# Altium schematic sheet 08_BB_Processor.SchDoc: BB Processor (part 2 of 3)
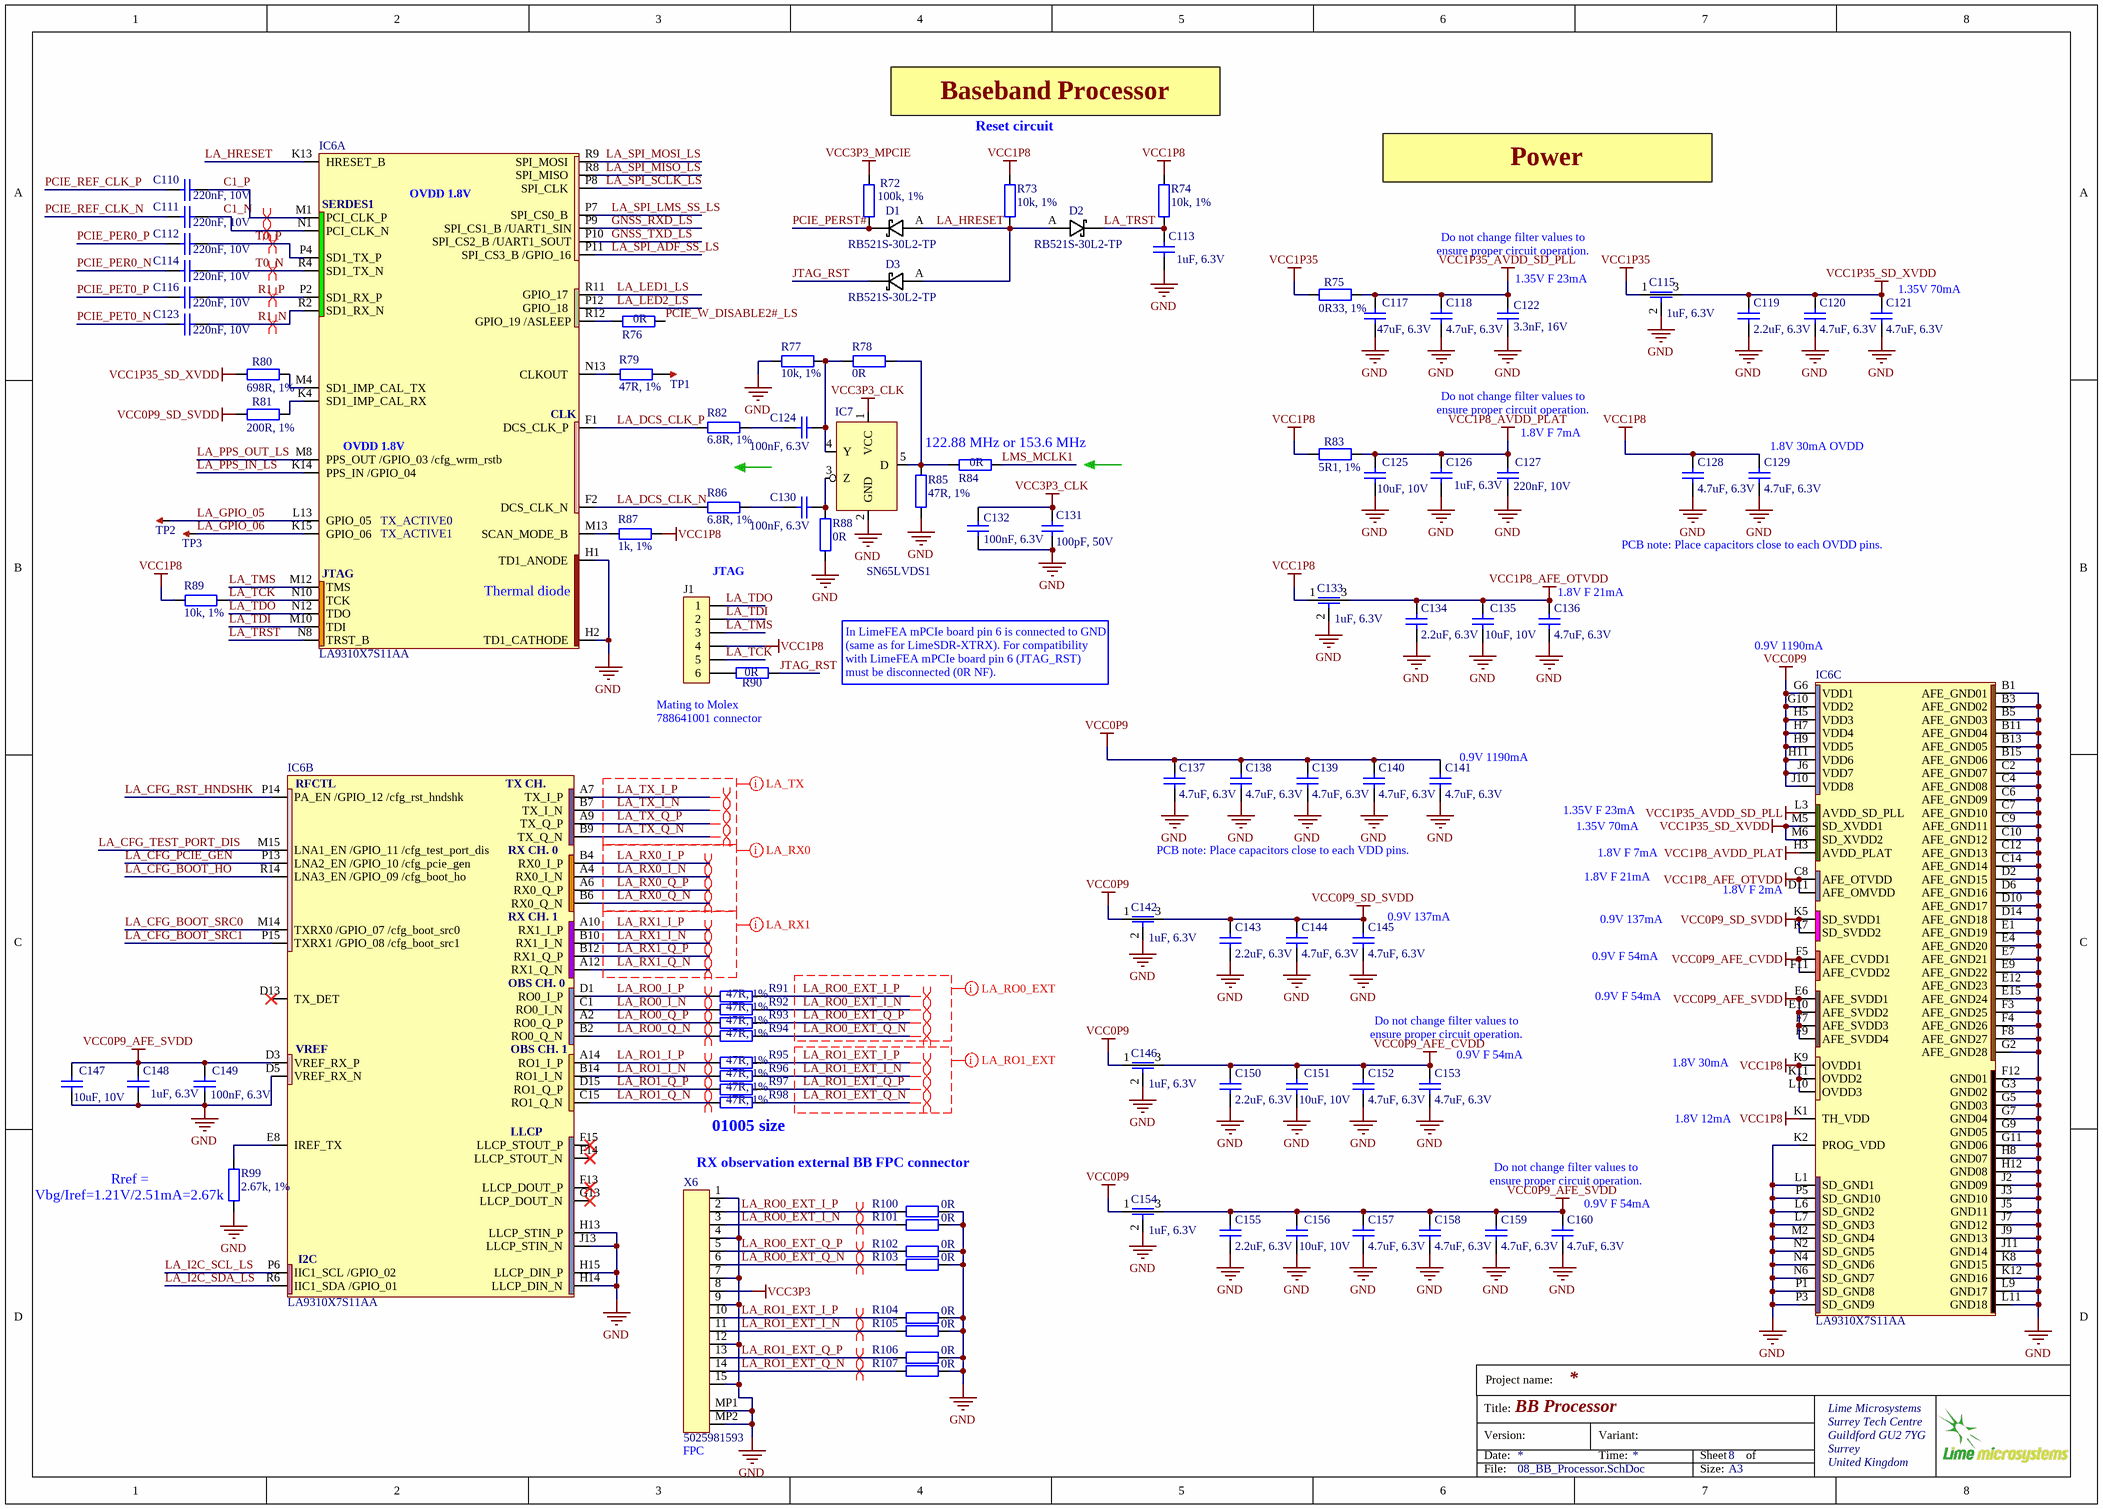
[diagram p1: 08_BB_Processor.SchDoc]
## Library data of the parts
C110-C112 C114 C116 C123 = Cap_0402: Manufacturer: Murata; Manufacturer Part Number 1: GRM033R61A224ME90D; Part Description: 0.22 µF ±20% 10V Ceramic Capacitor X5R 0201 (0603 Metric); Dielectric: X5R; Material: 4241ConductorMaterial; Tolerance: 20%; ComponentLink5Description: https://datasheet.ciiva.com/25788/cl03a104mp3nnnc-25788272.pdf?src-supplier=Digi-Key; ComponentLink5URL: https://datasheet.ciiva.com/25788/cl03a104mp3nnnc-25788272.pdf?src-supplier=Digi-Key; Capacitance: 220nF; Case/Package: 0201; Case Code (Imperial): 0201; Case Code (Metric): 0603; ComponentLink1Description: http://www.mouser.com/ds/2/281/c02e-2905.pdf?src-supplier=Mouser; ComponentLink1URL: http://www.mouser.com/ds/2/281/c02e-2905.pdf?src-supplier=Mouser; ComponentLink2Description: https://datasheet.octopart.com/GRM033R61A224ME90D-Murata-datasheet-22122223.pdf?src-supplier=Future+Electronics; ComponentLink2URL: https://datasheet.octopart.com/GRM033R61A224ME90D-Murata-datasheet-22122223.pdf?src-supplier=Future+Electronics; ComponentLink3Description: http://search.murata.co.jp/Ceramy/image/img/A01X/G101/ENG/GRM033R61A224ME90-01.pdf?src-supplier=Digi-Key; ComponentLink3URL: http://search.murata.co.jp/Ceramy/image/img/A01X/G101/ENG/GRM033R61A224ME90-01.pdf?src-supplier=Digi-Key; ComponentLink4Description: https://datasheet.octopart.com/GRM033R61A224ME90D-Murata-datasheet-165579666.pdf?src-supplier=TME; ComponentLink4URL: https://datasheet.octopart.com/GRM033R61A224ME90D-Murata-datasheet-165579666.pdf?src-supplier=TME; Depth: 0.3mm; Height: 0.3mm; Lead Free: Lead Free; Length: 0.6mm; Max Operating Temperature: 85°C; Min Operating Temperature: -55°C; Mount: Surface Mount; Package Quantity: 15000; Packaging: Tape and Reel; Pricing 1: 1=0,1, 10=0,026, 50=0,0148, 100=0,0115, 500=0,00866, 1000=0,0068, 2500=0,00618, 5000=0,00569 (USD); RoHS: Yes; RoHS Compliant: Yes; Series: GRM; Stock 1: 689026; Supplier 1: Digi-Key; Supplier Part Number 1: 490-9984-1-ND; Termination: SMD/SMT; Thickness: 0.013inch; Value: 220nF, 10V; Voltage: 10V; Voltage Rating (DC): 10V; Voltage Rating: 10V; Weight: 1.2E-05oz; Width: 0.012inch
C113 C126 C148 = Cap_0402: Manufacturer: TDK Corporation; Manufacturer Part Number 1: JMK063ABJ105MP-F; Part Description: 1µF ±20% 6.3V X5R Ceramic Capacitor -55°C ~ 85°C Surface Mount, MLCC 0201 (0603 Metric) 0.024" L x 0.012" W (0.60mm x 0.30mm); Value: 1uF, 20%; Tolerance: ±20%; Capacitance: 1.0µF; Temperature Coefficient: X5R; Supplier 1: Digi-Key; Supplier Part Number 1: 587-5864-2-ND; Applications: General Purpose; Features: -; Lead Style: -; Ratings: -; Thickness (Max): -; Lead Spacing: -; Height - Seated (Max): -; Size / Dimension: 0.024" L x 0.012" W (0.60mm x 0.30mm); Mounting Type: Surface Mount, MLCC; Operating Temperature: -55°C ~ 85°C; Package / Case: 0201 (0603 Metric); Packaging: Cut Tape (CT); Voltage - Rated: 6.3V; Category: Capacitors; RoHS: RoHS Compliant
C115 = Cap_feed_through: Part Description: 1 µF Feed Through Capacitor 6.3V 4 A 12mOhm 0603 (1608 Metric), 4 PC Pad; Manufacturer: TDK; Manufacturer Part Number 1: YFF18PH0J105MT000N; Value: 1uF, 6.3V; Supplier 1: Digi-Key; Supplier Part Number 1: 445-3029-1-ND; Stock 1: 22167; Pricing 1: 1=0,49, 10=0,326, 50=0,2404, 100=0,1957, 500=0,15448, 1000=0,13045 (USD); RoHS: Yes; ComponentLink1URL: http://www.farnell.com/datasheets/2211503.pdf?src-supplier=Farnell; ComponentLink1Description: http://www.farnell.com/datasheets/2211503.pdf?src-supplier=Farnell; ComponentLink2URL: https://product.tdk.com/info/en/catalog/datasheets/3tf_commercial_power_yff-p_en.pdf?ref_disty=digikey&src-supplier=Digi-Key; ComponentLink2Description: https://product.tdk.com/info/en/catalog/datasheets/3tf_commercial_power_yff-p_en.pdf?ref_disty=digikey&src-supplier=Digi-Key
C117 = Cap_0603: Part Description: 47 µF ±20% 6.3V Ceramic Capacitor X5R 0603 (1608 Metric); Manufacturer: Murata; Manufacturer Part Number 1: GRM188R60J476ME15D; Tolerance: 20%; Dielectric: X5R; Value: 47uF, 6.3V; Supplier 1: Digi-Key; Supplier Part Number 1: 490-13247-1-ND; Stock 1: 731453; Pricing 1: 1=0,45000, 10=0,31900, 50=0,24120, 100=0,21000, 500=0,15556, 1000=0,13223 (USD); RoHS: Yes; Mount: Surface Mount; Case/Package: 0603; Case Code (Metric): 1608; Case Code (Imperial): 0603; Min Operating Temperature: -55°C; Max Operating Temperature: 85°C; Packaging: Tape and Reel; Capacitance: 47uF; Voltage Rating: 6.3V; Voltage Rating (DC): 6.3V; Length: 0.063inch; Width: 0.031inch; Thickness: 0.039inch; RoHS Compliant: Yes; ComponentLink1URL: http://search.murata.co.jp/Ceramy/image/img/A01X/G101/ENG/GRM188R60J476ME15-01.pdf?src-supplier=Digi-Key; ComponentLink1Description: http://search.murata.co.jp/Ceramy/image/img/A01X/G101/ENG/GRM188R60J476ME15-01.pdf?src-supplier=Digi-Key; ComponentLink2URL: https://www.murata.com/~/media/webrenewal/support/library/catalog/products/capacitor/mlcc/c02e.ashx?la=en-us&src-supplier=Digi-Key; ComponentLink2Description: https://www.murata.com/~/media/webrenewal/support/library/catalog/products/capacitor/mlcc/c02e.ashx?la=en-us&src-supplier=Digi-Key
C118 = Cap_0402: Part Description: 4.7 µF ±20% 6.3V Ceramic Capacitor X5R 0201 (0603 Metric); Manufacturer: Murata; Manufacturer Part Number 1: GRM035R60J475ME15J; Material: 4241ConductorMaterial; Dielectric: 1537DielectricType; Tolerance: 20%; Value: 4.7uF, 6.3V; Supplier 1: Digi-Key; Supplier Part Number 1: 490-GRM035R60J475ME15JCT-ND; Stock 1: 92210; Pricing 1: 1=0,28, 10=0,183, 50=0,1154, 100=0,0923, 500=0,06668, 1000=0,05899, 2500=0,05642, 5000=0,05129 (USD); RoHS: Yes; Case/Package: 344Case; Min Operating Temperature: -55°C; Max Operating Temperature: 85°C; Capacitance: 4.7uF; Voltage Rating: 6.3V; Voltage Rating (DC): 6.3V; Length: 600um; Width: 300um; Height: 550um; Thickness: 500um; RoHS Compliant: Yes; ComponentLink1URL: https://datasheet.octopart.com/GRM035R60J475ME15J-Murata-datasheet-165579666.pdf?src-supplier=TME; ComponentLink1Description: https://datasheet.octopart.com/GRM035R60J475ME15J-Murata-datasheet-165579666.pdf?src-supplier=TME
C119 = Cap_0402: Part Description: CAP CER 2.2UF 6.3V X5R 0201; Manufacturer: Murata; Manufacturer Part Number 1: GRM033R60J225ME47D; Material: Ceramic; Tolerance: 20%; Dielectric: X5R; Value: 2.2uF, 6.3V; Supplier 1: Digi-Key; Supplier Part Number 1: 490-13225-1-ND; Stock 1: 8554536; Pricing 1: 1=0,19, 10=0,121, 50=0,0764, 100=0,0612, 500=0,04418, 1000=0,03909, 2500=0,03739, 5000=0,03399 (USD); RoHS: Yes; Mount: Surface Mount; Case/Package: 0201; Case Code (Metric): 0603; Case Code (Imperial): 0201; Min Operating Temperature: -55°C; Max Operating Temperature: 85°C; Packaging: Cut Tape; Capacitance: 2.2uF; Voltage Rating: 6.3V; Series: GRM; Voltage Rating (DC): 6.3V; Length: 0.024inch; Width: 0.012inch; Height: 390um; Thickness: 0.015inch; RoHS Compliant: Yes; ComponentLink1URL: https://datasheet.octopart.com/GRM033R60J225ME47D-Murata-datasheet-96971104.pdf?src-supplier=Future+Electronics; ComponentLink1Description: https://datasheet.octopart.com/GRM033R60J225ME47D-Murata-datasheet-96971104.pdf?src-supplier=Future+Electronics; ComponentLink2URL: http://search.murata.co.jp/Ceramy/image/img/A01X/G101/ENG/GRM033R60J225ME47-01.pdf?src-supplier=Digi-Key; ComponentLink2Description: http://search.murata.co.jp/Ceramy/image/img/A01X/G101/ENG/GRM033R60J225ME47-01.pdf?src-supplier=Digi-Key; ComponentLink3URL: https://datasheet.octopart.com/GRM033R60J225ME47D-Murata-datasheet-165579666.pdf?src-supplier=TME; ComponentLink3Description: https://datasheet.octopart.com/GRM033R60J225ME47D-Murata-datasheet-165579666.pdf?src-supplier=TME
C120 C121 C128 C129 C136-C141 C144 C145 C152 C153 C157-C160 = Cap_0402: Manufacturer: Murata; Manufacturer Part Number 1: GRM035R60J475ME15J; Part Description: 4.7 µF ±20% 6.3V Ceramic Capacitor X5R 0201 (0603 Metric); Dielectric: 1537DielectricType; Material: 4241ConductorMaterial; Tolerance: 20%; Capacitance: 4.7uF; Case/Package: 344Case; ComponentLink1Description: https://datasheet.octopart.com/GRM035R60J475ME15J-Murata-datasheet-165579666.pdf?src-supplier=TME; ComponentLink1URL: https://datasheet.octopart.com/GRM035R60J475ME15J-Murata-datasheet-165579666.pdf?src-supplier=TME; Height: 550um; Length: 600um; Max Operating Temperature: 85°C; Min Operating Temperature: -55°C; Pricing 1: 1=0,28, 10=0,183, 50=0,1154, 100=0,0923, 500=0,06668, 1000=0,05899, 2500=0,05642, 5000=0,05129 (USD); RoHS: Yes; RoHS Compliant: Yes; Stock 1: 92210; Supplier 1: Digi-Key; Supplier Part Number 1: 490-GRM035R60J475ME15JCT-ND; Thickness: 500um; Value: 4.7uF, 6.3V; Voltage Rating (DC): 6.3V; Voltage Rating: 6.3V; Width: 300um
C122 = Cap_0402: Part Description: 3300 pF ±10% 16V Ceramic Capacitor X7R 0201 (0603 Metric); Manufacturer: Murata; Manufacturer Part Number 1: GRM033R71C332KA88D; Value: 3.3nF, 16V; ComponentLink5Description: https://datasheet.ciiva.com/25788/cl03a104mp3nnnc-25788272.pdf?src-supplier=Digi-Key; ComponentLink5URL: https://datasheet.ciiva.com/25788/cl03a104mp3nnnc-25788272.pdf?src-supplier=Digi-Key; ComponentLink1URL: https://datasheet.ciiva.com/18699/grm033r61c333ke84-01-18699265.pdf?src-supplier=Digi-Key; ComponentLink1Description: https://datasheet.ciiva.com/18699/grm033r61c333ke84-01-18699265.pdf?src-supplier=Digi-Key; ComponentLink2URL: https://datasheet.ciiva.com/24223/c02e-24223974.pdf?src-supplier=Mouser; ComponentLink2Description: https://datasheet.ciiva.com/24223/c02e-24223974.pdf?src-supplier=Mouser; Supplier 1: Digikey; Supplier Part Number 1: 490-3191-1-ND; Stock 1: 176450; Pricing 1: 1=0,1, 10=0,02, 50=0,0118, 100=0,0091, 500=0,00684, 1000=0,00538, 2500=0,00489, 5000=0,0045 (USD); RoHS: Yes; Lead Free: 5697LeadFree; ComponentLink3URL: https://datasheet.ciiva.com/18184/getdatasheetpartid-467171-18184093.pdf?src-supplier=Verical; ComponentLink3Description: https://datasheet.ciiva.com/18184/getdatasheetpartid-467171-18184093.pdf?src-supplier=Verical; ComponentLink4URL: https://datasheet.ciiva.com/129/grm033r71c332ka88-01-129900.pdf?src-supplier=Digikey; ComponentLink4Description: https://datasheet.ciiva.com/129/grm033r71c332ka88-01-129900.pdf?src-supplier=Digikey; ComponentLink6URL: https://datasheet.ciiva.com/129/grm033r71c332ka88-01-129901.pdf?src-supplier=Digikey; ComponentLink6Description: https://datasheet.ciiva.com/129/grm033r71c332ka88-01-129901.pdf?src-supplier=Digikey; ComponentLink7URL: https://datasheet.ciiva.com/129/grm033r71c332ka88-01-129902.pdf?src-supplier=Digikey; ComponentLink7Description: https://datasheet.ciiva.com/129/grm033r71c332ka88-01-129902.pdf?src-supplier=Digikey; ComponentLink8URL: https://datasheet.ciiva.com/11620/product-11620449.pdf?src-supplier=Avnet; ComponentLink8Description: https://datasheet.ciiva.com/11620/product-11620449.pdf?src-supplier=Avnet
C124 C130 C132 C149 = Cap_0402: Part Description: 0.1 µF ±20% 10V Ceramic Capacitor X5R 0201 (0603 Metric); Manufacturer: Samsung; Manufacturer Part Number 1: CL03A104MP3NNNC; Tolerance: 20%; Voltage Rating (DC): 10V; Value: 100nF, 6.3V; Capacitance: 100nF; Case/Package: 0201; Case Code (Imperial): 0201; Case Code (Metric): 0603; ComponentLink5Description: https://datasheet.ciiva.com/25788/cl03a104mp3nnnc-25788272.pdf?src-supplier=Digi-Key; ComponentLink5URL: https://datasheet.ciiva.com/25788/cl03a104mp3nnnc-25788272.pdf?src-supplier=Digi-Key; Length: 0.024inch; Max Operating Temperature: 85°C; Min Operating Temperature: -55°C; Mount: Surface Mount; Package Quantity: 1; Packaging: Tape and Reel; Pricing 1: 1=0,10000, 10=0,03000, 50=0,01640, 100=0,01330, 500=0,00950, 1000=0,00747, 2500=0,00679, 5000=0,00625 (USD); RoHS: Yes; RoHS Compliant: Yes; Series: CL; Stock 1: 3817176; Supplier 1: Digi-Key; Supplier Part Number 1: 1276-1321-1-ND; Thickness: 0.013inch; Voltage Rating: 10V; Width: 0.012inch
C125 C135 C147 C151 C156 = Cap_0603: Part Description: 10 µF ±20% 10V Ceramic Capacitor X5R 0402 (1005 Metric); Manufacturer: Murata; Manufacturer Part Number 1: GRM155R61A106ME11D; Value: 10uF, 10V; ComponentLink1Description: http://search.murata.co.jp/Ceramy/image/img/A01X/G101/ENG/GRM188R61C106MAAL-01.pdf?src-supplier=Digi-Key; ComponentLink1URL: http://search.murata.co.jp/Ceramy/image/img/A01X/G101/ENG/GRM188R61C106MAAL-01.pdf?src-supplier=Digi-Key; ComponentLink2Description: https://search.murata.co.jp/Ceramy/image/img/A01X/G101/ENG/GRM188R61C106MAAL-01.pdf?src-supplier=Digi-Key; ComponentLink2URL: https://search.murata.co.jp/Ceramy/image/img/A01X/G101/ENG/GRM188R61C106MAAL-01.pdf?src-supplier=Digi-Key; ComponentLink3Description: http://search.murata.co.jp/Ceramy/image/img/A01X/partnumbering_e_01.pdf?src-supplier=Digi-Key; ComponentLink3URL: http://search.murata.co.jp/Ceramy/image/img/A01X/partnumbering_e_01.pdf?src-supplier=Digi-Key; ComponentLink4Description: http://www.farnell.com/datasheets/1872210.pdf?src-supplier=Farnell; ComponentLink4URL: http://www.farnell.com/datasheets/1872210.pdf?src-supplier=Farnell; ComponentLink5Description: http://www.mouser.com/ds/2/281/c02e-2905.pdf?src-supplier=Mouser; ComponentLink5URL: http://www.mouser.com/ds/2/281/c02e-2905.pdf?src-supplier=Mouser; ComponentLink6Description: http://www.farnell.com/datasheets/1872210.pdf?src-supplier=Newark; ComponentLink6URL: http://www.farnell.com/datasheets/1872210.pdf?src-supplier=Newark; ComponentLink7Description: http://www.farnell.com/datasheets/2048014.pdf?src-supplier=Element14; ComponentLink7URL: http://www.farnell.com/datasheets/2048014.pdf?src-supplier=Element14; ComponentLink8Description: http://www.farnell.com/datasheets/1872210.pdf?src-supplier=Element14; ComponentLink8URL: http://www.farnell.com/datasheets/1872210.pdf?src-supplier=Element14; ComponentLink9Description: http://search.murata.co.jp/Ceramy/image/img/A01X/G101/ENG/GRM188R61A106ME69-01.pdf?src-supplier=Digi-Key; ComponentLink9URL: http://search.murata.co.jp/Ceramy/image/img/A01X/G101/ENG/GRM188R61A106ME69-01.pdf?src-supplier=Digi-Key; Supplier 1: Digi-Key; Supplier Part Number 1: 490-GRM155R61A106ME11DCT-ND; Stock 1: 185401; Pricing 1: 1=0,13, 10=0,091, 50=0,054, 100=0,0425, 500=0,03142, 1000=0,02601, 2500=0,0242, 5000=0,02214 (USD); RoHS: Yes; RoHS Compliant: Yes; ComponentLink10URL: https://datasheet.octopart.com/GRM155R61A106ME11D-Murata-datasheet-155239053.pdf?src-supplier=Element14; ComponentLink10Description: https://datasheet.octopart.com/GRM155R61A106ME11D-Murata-datasheet-155239053.pdf?src-supplier=Element14; ComponentLink11URL: https://datasheet.octopart.com/GRM155R61A106ME11D-Murata-datasheet-165579666.pdf?src-supplier=TME; ComponentLink11Description: https://datasheet.octopart.com/GRM155R61A106ME11D-Murata-datasheet-165579666.pdf?src-supplier=TME
C127 = Cap_0402: Part Description: 0.22 µF ±20% 10V Ceramic Capacitor X5R 0201 (0603 Metric); Manufacturer: Murata; Manufacturer Part Number 1: GRM033R61A224ME90D; Material: 4241ConductorMaterial; Tolerance: 20%; Dielectric: X5R; Value: 220nF, 10V; ComponentLink5Description: https://datasheet.ciiva.com/25788/cl03a104mp3nnnc-25788272.pdf?src-supplier=Digi-Key; ComponentLink5URL: https://datasheet.ciiva.com/25788/cl03a104mp3nnnc-25788272.pdf?src-supplier=Digi-Key; Supplier 1: Digi-Key; Supplier Part Number 1: 490-9984-1-ND; Stock 1: 689026; Pricing 1: 1=0,1, 10=0,026, 50=0,0148, 100=0,0115, 500=0,00866, 1000=0,0068, 2500=0,00618, 5000=0,00569 (USD); RoHS: Yes; Mount: Surface Mount; Case/Package: 0201; Case Code (Metric): 0603; Case Code (Imperial): 0201; Weight: 1.2E-05oz; Min Operating Temperature: -55°C; Max Operating Temperature: 85°C; Capacitance: 220nF; Voltage Rating (DC): 10V; Packaging: Tape and Reel; Voltage Rating: 10V; Voltage: 10V; Termination: SMD/SMT; Package Quantity: 15000; Series: GRM; Length: 0.6mm; Width: 0.012inch; Height: 0.3mm; Thickness: 0.013inch; Depth: 0.3mm; Lead Free: Lead Free; RoHS Compliant: Yes; ComponentLink1URL: http://www.mouser.com/ds/2/281/c02e-2905.pdf?src-supplier=Mouser; ComponentLink1Description: http://www.mouser.com/ds/2/281/c02e-2905.pdf?src-supplier=Mouser; ComponentLink2URL: https://datasheet.octopart.com/GRM033R61A224ME90D-Murata-datasheet-22122223.pdf?src-supplier=Future+Electronics; ComponentLink2Description: https://datasheet.octopart.com/GRM033R61A224ME90D-Murata-datasheet-22122223.pdf?src-supplier=Future+Electronics; ComponentLink3URL: http://search.murata.co.jp/Ceramy/image/img/A01X/G101/ENG/GRM033R61A224ME90-01.pdf?src-supplier=Digi-Key; ComponentLink3Description: http://search.murata.co.jp/Ceramy/image/img/A01X/G101/ENG/GRM033R61A224ME90-01.pdf?src-supplier=Digi-Key; ComponentLink4URL: https://datasheet.octopart.com/GRM033R61A224ME90D-Murata-datasheet-165579666.pdf?src-supplier=TME; ComponentLink4Description: https://datasheet.octopart.com/GRM033R61A224ME90D-Murata-datasheet-165579666.pdf?src-supplier=TME
C131 = Cap_0402: Part Description: 100 pF ±5% 50V Ceramic Capacitor C0G, NP0 0201 (0603 Metric); Manufacturer: TDK; Manufacturer Part Number 1: C0603C0G1H101J030BA; Dielectric Material: Ceramic; Tolerance: 5%; Dielectric: C0G; Insulation Resistance: 10GR; Value: 100pF, 50V; Supplier 1: Digi-Key; Supplier Part Number 1: 445-1786-1-ND; Stock 1: 367528; Pricing 1: 1=0,10000, 10=0,06000, 50=0,03280, 100=0,02670, 500=0,01908, 1000=0,01500, 2500=0,01364, 5000=0,01254 (USD); RoHS: Yes; Mount: Surface Mount; Case/Package: 0201; Number of Pins: 2; Case Code (Metric): 0603; Case Code (Imperial): 0201; Weight: 6E-06oz; Min Operating Temperature: -55°C; Max Operating Temperature: 125°C; Package Quantity: 1; Capacitance: 100pF; Voltage Rating: 50V; Packaging: Tape and Reel; Voltage Rating (DC): 50V; Termination: SMD/SMT; Voltage: 50V; Series: C; Construction: Flat; Length: 0.6mm; Width: 0.012inch; Height: 0.3mm; Thickness: 0.013inch; Depth: 0.3mm; Reach SVHC Compliant: Yes; Lead Free: Lead Free; RoHS Compliant: Yes; ComponentLink1URL: https://datasheet.ciiva.com/24217/c0603c0g1h101j030ba-264106-24217425.pdf?src-supplier=Mouser; ComponentLink1Description: https://datasheet.ciiva.com/24217/c0603c0g1h101j030ba-264106-24217425.pdf?src-supplier=Mouser; ComponentLink2URL: https://datasheet.ciiva.com/16205/mlcc-commercial-general-en-16205590.pdf?src-supplier=Future+Electronics; ComponentLink2Description: https://datasheet.ciiva.com/16205/mlcc-commercial-general-en-16205590.pdf?src-supplier=Future+Electronics; ComponentLink3URL: https://datasheet.ciiva.com/6250/tdkmlcccaprange-6250351.pdf?src-supplier=Digi-Key; ComponentLink3Description: https://datasheet.ciiva.com/6250/tdkmlcccaprange-6250351.pdf?src-supplier=Digi-Key
C133 C142 C146 C154 = Cap_feed_through: Manufacturer: TDK; Manufacturer Part Number 1: YFF18PH0J105MT000N; Part Description: 1 µF Feed Through Capacitor 6.3V 4 A 12mOhm 0603 (1608 Metric), 4 PC Pad; ComponentLink1Description: http://www.farnell.com/datasheets/2211503.pdf?src-supplier=Farnell; ComponentLink1URL: http://www.farnell.com/datasheets/2211503.pdf?src-supplier=Farnell; ComponentLink2Description: https://product.tdk.com/info/en/catalog/datasheets/3tf_commercial_power_yff-p_en.pdf?ref_disty=digikey&src-supplier=Digi-Key; ComponentLink2URL: https://product.tdk.com/info/en/catalog/datasheets/3tf_commercial_power_yff-p_en.pdf?ref_disty=digikey&src-supplier=Digi-Key; Pricing 1: 1=0,49, 10=0,326, 50=0,2404, 100=0,1957, 500=0,15448, 1000=0,13045 (USD); RoHS: Yes; Stock 1: 22167; Supplier 1: Digi-Key; Supplier Part Number 1: 445-3029-1-ND; Value: 1uF, 6.3V
C134 C143 C150 C155 = Cap_0402: Manufacturer: Murata; Manufacturer Part Number 1: GRM033R60J225ME47D; Part Description: CAP CER 2.2UF 6.3V X5R 0201; Dielectric: X5R; Material: Ceramic; Tolerance: 20%; Capacitance: 2.2uF; Case/Package: 0201; Case Code (Imperial): 0201; Case Code (Metric): 0603; ComponentLink1Description: https://datasheet.octopart.com/GRM033R60J225ME47D-Murata-datasheet-96971104.pdf?src-supplier=Future+Electronics; ComponentLink1URL: https://datasheet.octopart.com/GRM033R60J225ME47D-Murata-datasheet-96971104.pdf?src-supplier=Future+Electronics; ComponentLink2Description: http://search.murata.co.jp/Ceramy/image/img/A01X/G101/ENG/GRM033R60J225ME47-01.pdf?src-supplier=Digi-Key; ComponentLink2URL: http://search.murata.co.jp/Ceramy/image/img/A01X/G101/ENG/GRM033R60J225ME47-01.pdf?src-supplier=Digi-Key; ComponentLink3Description: https://datasheet.octopart.com/GRM033R60J225ME47D-Murata-datasheet-165579666.pdf?src-supplier=TME; ComponentLink3URL: https://datasheet.octopart.com/GRM033R60J225ME47D-Murata-datasheet-165579666.pdf?src-supplier=TME; Height: 390um; Length: 0.024inch; Max Operating Temperature: 85°C; Min Operating Temperature: -55°C; Mount: Surface Mount; Packaging: Cut Tape; Pricing 1: 1=0,19, 10=0,121, 50=0,0764, 100=0,0612, 500=0,04418, 1000=0,03909, 2500=0,03739, 5000=0,03399 (USD); RoHS: Yes; RoHS Compliant: Yes; Series: GRM; Stock 1: 8554536; Supplier 1: Digi-Key; Supplier Part Number 1: 490-13225-1-ND; Thickness: 0.015inch; Value: 2.2uF, 6.3V; Voltage Rating (DC): 6.3V; Voltage Rating: 6.3V; Width: 0.012inch
D1-D3 = BAT46JFILM_shottky_diode: Manufacturer: MCC; Part Description: DIODE SCHOTTKY 30V 100MA 2TDFN; Average Rectified Current: 100mA; Max Reverse Voltage (DC): 30V; Value: RB521S-30L2-TP; Supplier 1: Digi-Key; Supplier Part Number 1: RB521S-30L2-TPMSCT-ND; Manufacturer Part Number 1: RB521S-30L2-TP; Stock 1: 268886; Pricing 1: 1=0,24, 10=0,165, 100=0,0805, 500=0,06712, 1000=0,04664, 2000=0,04043, 5000=0,0375 (USD); RoHS: Yes; Mount: Surface Mount; Case/Package: 0402; Case Code (Imperial): 0402; Case Code (Metric): 1006; Packaging: Cut Tape; Series: -; RoHS Compliant: Yes; ComponentLink1URL: http://www.mccsemi.com/up_pdf/RB521S-30L2(DFN1006-2L)-A.pdf?src-supplier=Digi-Key; ComponentLink1Description: http://www.mccsemi.com/up_pdf/RB521S-30L2(DFN1006-2L)-A.pdf?src-supplier=Digi-Key
IC6 = LA9310X7S11AA: Part Description: LFBGA157, low profile, fine-pitch ball grid array package, 157 terminals, 0.5 mm pitch, 8 mm x 8 mm x 1.25 mm body.; Manufacturer: NXP Semiconductors; Manufacturer Part Number 1: LA9310X7S11AA; Supplier 1: NXP Semiconductors; Supplier Part Number 1: LA9310X7S11AA
IC7 = SN65LVDS1: Manufacturer: TEXAS INSTRUMENTS; Manufacturer Part Number 1: SN65LVDS1DBVR; Part Description: DIFFERENTIAL LINE DRIVER/RECEIVER SIGNAL SOT23-5; Supply Voltage Min: 2.4; Supply Voltage Max: 3.6; No. of Pins: 5; Driver Case Style: SOT-23; Supplier 1: Newark; Supplier Part Number 1: 76C0715
J1 = Molex_0788641001_spring_contacts: Header, 6-pin; Part Description: 6 Position Spring Battery Contact Connector Surface Mount; Manufacturer Part Number 1: 78864-1001; Voltage Rating: 10V; Number of Contacts: 6; Glow Wire Compliant: Non-compliant; Supplier 1: Digi-Key; Supplier Part Number 1: WM11204CT-ND; Manufacturer: Molex; Stock 1: 133097; Pricing 1: 1=0,45000, 10=0,36500, 100=0,26730, 1000=0,21263 (USD); RoHS: Yes; Contact Material: Copper Alloy; Orientation: Vertical; Voltage Rating (DC): 10V; Number of Circuits: 6; Halogen Free: Low Halogen; ComponentLink1URL: http://www.farnell.com/datasheets/2216617.pdf?src-supplier=Farnell; ComponentLink1Description: http://www.farnell.com/datasheets/2216617.pdf?src-supplier=Farnell; ComponentLink2URL: http://www.farnell.com/datasheets/2216617.pdf?src-supplier=Newark; ComponentLink2Description: http://www.farnell.com/datasheets/2216617.pdf?src-supplier=Newark; ComponentLink3URL: http://www.farnell.com/datasheets/1862322.pdf?src-supplier=Element14; ComponentLink3Description: http://www.farnell.com/datasheets/1862322.pdf?src-supplier=Element14
R72 = Res_0402: Part Description: 100 kOhms ±1% 0.05W, 1/20W Chip Resistor 0201 (0603 Metric) Moisture Resistant Thick Film; Manufacturer: Yageo; Manufacturer Part Number 1: RC0201FR-07100KL; Resistance: 100kR; Power Rating: 50mW; Voltage Rating: 25V; Temperature Coefficient: 200ppm/°C; ComponentLink1URL: https://datasheet.ciiva.com/7672/1563626-7672204.pdf?src-supplier=Element14; ComponentLink1Description: https://datasheet.ciiva.com/7672/1563626-7672204.pdf?src-supplier=Element14; Value: 100k, 1%; Supplier 1: Digi-Key; Supplier Part Number 1: 311-100KMCT-ND; Stock 1: 6001055; Pricing 1: 1=0,10000, 10=0,03700, 100=0,01500, 1000=0,00672, 2500=0,00583, 5000=0,00482 (USD); RoHS: Yes; Case/Package: 0201; Case Code (Metric): 0603; Case Code (Imperial): 0201; Min Operating Temperature: -55°C; Max Operating Temperature: 125°C; Tolerance: 1%; Packaging: Tape and Reel; Package Quantity: 10000; Resistor Type: Thick Film; Number of Terminations: 2; Termination: SMD/SMT; Max Power Dissipation: 50mW; Features: Moisture Resistant; Series: RC; Construction: Rectangular; Resistance Tolerance: 1%; Length: 0.024inch; Width: 0.012inch; Height: 0.01inch; Depth: 0.3mm; Military Standard: Not; RoHS Compliant: Yes; ComponentLink2URL: https://datasheet.ciiva.com/22698/1563626-22698505.pdf?src-supplier=Element14; ComponentLink2Description: https://datasheet.ciiva.com/22698/1563626-22698505.pdf?src-supplier=Element14; ComponentLink3URL: https://datasheet.ciiva.com/29721/pyu-r-int-thick-7-29721196.pdf?src-supplier=Digi-Key; ComponentLink3Description: https://datasheet.ciiva.com/29721/pyu-r-int-thick-7-29721196.pdf?src-supplier=Digi-Key; ComponentLink4Description: https://datasheet.ciiva.com/29721/pyu-r-int-thick-7-29721195.pdf?src-supplier=Digi-Key; ComponentLink4URL: https://datasheet.ciiva.com/29721/pyu-r-int-thick-7-29721195.pdf?src-supplier=Digi-Key; ComponentLink5Description: https://datasheet.ciiva.com/8896/pyu-rc0201-51-rohs-l-8-8896174.pdf?src-supplier=Avnet; ComponentLink5URL: https://datasheet.ciiva.com/8896/pyu-rc0201-51-rohs-l-8-8896174.pdf?src-supplier=Avnet; ComponentLink6Description: https://datasheet.ciiva.com/7660/1421516-7660806.pdf?src-supplier=Element14; ComponentLink6URL: https://datasheet.ciiva.com/7660/1421516-7660806.pdf?src-supplier=Element14; ComponentLink7Description: https://datasheet.ciiva.com/22698/1563626-22698495.pdf?src-supplier=Element14; ComponentLink7URL: https://datasheet.ciiva.com/22698/1563626-22698495.pdf?src-supplier=Element14; ComponentLink8Description: https://datasheet.ciiva.com/46391/1421516-46391338.pdf?src-supplier=Element14; ComponentLink8URL: https://datasheet.ciiva.com/46391/1421516-46391338.pdf?src-supplier=Element14; ComponentLink9Description: https://datasheet.ciiva.com/2493/pyu-r-int-thick-7-2493770.pdf?src-supplier=Digi-Key; ComponentLink9URL: https://datasheet.ciiva.com/2493/pyu-r-int-thick-7-2493770.pdf?src-supplier=Digi-Key; ComponentLink10Description: https://datasheet.ciiva.com/2493/pyu-r-int-thick-7-2493771.pdf?src-supplier=Digi-Key; ComponentLink10URL: https://datasheet.ciiva.com/2493/pyu-r-int-thick-7-2493771.pdf?src-supplier=Digi-Key; ComponentLink11Description: https://datasheet.ciiva.com/2493/pyu-r-int-thick-7-2493769.pdf?src-supplier=Digi-Key; ComponentLink11URL: https://datasheet.ciiva.com/2493/pyu-r-int-thick-7-2493769.pdf?src-supplier=Digi-Key; ComponentLink12Description: https://datasheet.ciiva.com/26829/getdatasheetpartid-420441-26829850.pdf?src-supplier=Verical; ComponentLink12URL: https://datasheet.ciiva.com/26829/getdatasheetpartid-420441-26829850.pdf?src-supplier=Verical; Contact Plating: Tin,Matte; Lead Free: Lead Free; Number of Pins: 2; Reach SVHC Compliant: Yes; Size Code: 0201; Voltage Rating (DC): 25V
R73 R74 R77 R89 = Res_0402: Manufacturer: Yageo; Manufacturer Part Number 1: RC0201FR-0710KL; Part Description: 10 kOhms ±1% 0.05W, 1/20W Chip Resistor 0201 (0603 Metric) Moisture Resistant Thick Film; Resistance: 10kR; Power Rating: 50mW; Voltage Rating: 25V; Temperature Coefficient: 200ppm/°C; Value: 10k, 1%; ComponentLink1URL: https://datasheet.ciiva.com/5924/1563626-5924912.pdf?src-supplier=Farnell; ComponentLink1Description: https://datasheet.ciiva.com/5924/1563626-5924912.pdf?src-supplier=Farnell; ComponentLink2URL: https://datasheet.ciiva.com/22661/1563626-22661319.pdf?src-supplier=Element14; ComponentLink2Description: https://datasheet.ciiva.com/22661/1563626-22661319.pdf?src-supplier=Element14; Supplier 1: Digi-Key; Supplier Part Number 1: 311-10.0KMCT-ND; Stock 1: 17142315; Pricing 1: 1=0,10000, 10=0,03700, 100=0,01530, 1000=0,00685, 2500=0,00595, 5000=0,00491 (USD); RoHS: Yes; Case/Package: 0201; Number of Pins: 2; Case Code (Imperial): 0201; Case Code (Metric): 0603; Contact Plating: Tin,Matte; Weight: 6E-06oz; Min Operating Temperature: -55°C; Max Operating Temperature: 125°C; Tolerance: 1%; Packaging: Tape and Reel; Package Quantity: 10000; Termination: SMD/SMT; Resistor Type: Thick Film; Number of Terminations: 2; Max Power Dissipation: 50mW; Voltage Rating (DC): 25V; Features: Moisture Resistant; Series: RC; Resistance Tolerance: 1%; Construction: Rectangular; Working Voltage: 25V; Technology: THICK FILM; Length: 0.6mm; Width: 0.012inch; Height: 0.01inch; Depth: 0.3mm; Radiation Hardening: No; Reach SVHC Compliant: Yes; Military Standard: Not; Lead Free: Lead Free; RoHS Compliant: Yes; ComponentLink3URL: https://datasheet.ciiva.com/7660/1421516-7660807.pdf?src-supplier=Element14; ComponentLink3Description: https://datasheet.ciiva.com/7660/1421516-7660807.pdf?src-supplier=Element14; ComponentLink4URL: https://datasheet.ciiva.com/46391/1421516-46391339.pdf?src-supplier=Element14; ComponentLink4Description: https://datasheet.ciiva.com/46391/1421516-46391339.pdf?src-supplier=Element14; ComponentLink5URL: https://datasheet.ciiva.com/2467/pyu-r-int-thick-7-2467110.pdf?src-supplier=Digi-Key; ComponentLink5Description: https://datasheet.ciiva.com/2467/pyu-r-int-thick-7-2467110.pdf?src-supplier=Digi-Key; ComponentLink6URL: https://datasheet.ciiva.com/2467/pyu-r-int-thick-7-2467111.pdf?src-supplier=Digi-Key; ComponentLink6Description: https://datasheet.ciiva.com/2467/pyu-r-int-thick-7-2467111.pdf?src-supplier=Digi-Key; ComponentLink7URL: https://datasheet.ciiva.com/2467/pyu-r-int-thick-7-2467109.pdf?src-supplier=Digi-Key; ComponentLink7Description: https://datasheet.ciiva.com/2467/pyu-r-int-thick-7-2467109.pdf?src-supplier=Digi-Key
R75 = Res_0402: Part Description: 330 mOhms ±1% 0.1W, 1/10W Chip Resistor 0201 (0603 Metric) Current Sense Metal Film; Manufacturer: Ohmite; Manufacturer Part Number 1: KDV02FR330ET; Value: 0R33, 1%; ComponentLink1URL: https://datasheet.ciiva.com/5924/1563626-5924912.pdf?src-supplier=Farnell; ComponentLink1Description: https://datasheet.ciiva.com/5924/1563626-5924912.pdf?src-supplier=Farnell; ComponentLink2URL: https://datasheet.ciiva.com/22661/1563626-22661319.pdf?src-supplier=Element14; ComponentLink2Description: https://datasheet.ciiva.com/22661/1563626-22661319.pdf?src-supplier=Element14; ComponentLink3URL: https://datasheet.ciiva.com/7672/1563626-7672202.pdf?src-supplier=Element14; ComponentLink3Description: https://datasheet.ciiva.com/7672/1563626-7672202.pdf?src-supplier=Element14; ComponentLink4URL: https://datasheet.ciiva.com/2493/pyu-r-int-thick-7-2493785.pdf?src-supplier=Digi-Key; ComponentLink4Description: https://datasheet.ciiva.com/2493/pyu-r-int-thick-7-2493785.pdf?src-supplier=Digi-Key; ComponentLink5URL: https://datasheet.ciiva.com/2493/pyu-r-int-thick-7-2493786.pdf?src-supplier=Digi-Key; ComponentLink5Description: https://datasheet.ciiva.com/2493/pyu-r-int-thick-7-2493786.pdf?src-supplier=Digi-Key; ComponentLink6URL: https://datasheet.ciiva.com/2493/pyu-r-int-thick-7-2493784.pdf?src-supplier=Digi-Key; ComponentLink6Description: https://datasheet.ciiva.com/2493/pyu-r-int-thick-7-2493784.pdf?src-supplier=Digi-Key; Supplier 1: Digi-Key; Supplier Part Number 1: 273-KDV02FR330ETCT-ND; Stock 1: 6155; Pricing 1: 1=0,45, 10=0,324, 25=0,26, 50=0,193, 100=0,1361, 250=0,12124, 500=0,10392, 1000=0,07918, 5000=0,06681 (USD); RoHS: No
R76 R78 R84 R88 R90 = Res_0402: Part Description: 0 Ohms Jumper Chip Resistor 0201 (0603 Metric) Moisture Resistant Thick Film; Manufacturer: Yageo; Manufacturer Part Number 1: RC0201JR-070RL; Power Rating: 50mW; Tolerance: 5%; Voltage Rating: 25V; ComponentLink1URL: http://www.yageo.com/documents/recent/PYu-RC_Group_51_RoHS_L_7.pdf; ComponentLink1Description: http://www.yageo.com/documents/recent/PYu-RC_Group_51_RoHS_L_7.pdf; Value: 0R; Supplier 1: Digi-Key; Supplier Part Number 1: 311-0.0NCT-ND; Stock 1: 6252381; Pricing 1: 1=0,10000, 10=0,03700, 25=0,02680, 50=0,02020, 100=0,01500, 250=0,01140, 500=0,00912, 1000=0,00672, 5000=0,00482 (USD); RoHS: Yes; Case/Package: 0201; Case Code (Metric): 0603; Case Code (Imperial): 0201; Weight: 6E-06oz; Contact Plating: Tin,Matte; Size Code: 0201; Min Operating Temperature: -55°C; Max Operating Temperature: 125°C; Packaging: Tape and Reel; Resistance: 0R; Package Quantity: 1; Resistor Type: Thick Film; Number of Terminations: 2; Termination: SMD/SMT; Max Power Dissipation: 50mW; Voltage Rating (DC): 25V; Features: Moisture Resistant; Series: RC; Construction: Rectangular; Resistance Tolerance: 5%; Length: 0.024inch; Width: 0.012inch; Height: 0.01inch; Depth: 0.3mm; Radiation Hardening: No; Military Standard: Not; Lead Free: Lead Free; RoHS Compliant: Yes; ComponentLink2URL: https://datasheet.ciiva.com/7672/1563626-7672248.pdf?src-supplier=Element14; ComponentLink2Description: https://datasheet.ciiva.com/7672/1563626-7672248.pdf?src-supplier=Element14; ComponentLink3URL: https://datasheet.ciiva.com/7672/1563626-7672247.pdf?src-supplier=Element14; ComponentLink3Description: https://datasheet.ciiva.com/7672/1563626-7672247.pdf?src-supplier=Element14; ComponentLink4URL: https://datasheet.ciiva.com/7660/1421516-7660808.pdf?src-supplier=Element14; ComponentLink4Description: https://datasheet.ciiva.com/7660/1421516-7660808.pdf?src-supplier=Element14; ComponentLink5URL: https://datasheet.ciiva.com/46391/1421516-46391340.pdf?src-supplier=Element14; ComponentLink5Description: https://datasheet.ciiva.com/46391/1421516-46391340.pdf?src-supplier=Element14
R79 R85 = Res_0402: Manufacturer: Yageo; Manufacturer Part Number 1: RC0201FR-0747RL; Part Description: 47 Ohms ±1% 0.05W, 1/20W Chip Resistor 0201 (0603 Metric) Moisture Resistant Thick Film; Power Rating: 50mW; Voltage Rating: 25V; Temperature Coefficient: 200ppm/°C; Value: 47R, 1%; Supplier 1: Digi-Key; Supplier Part Number 1: YAG2694CT-ND; Stock 1: 778022; Pricing 1: 1=0,10000, 10=0,03700, 100=0,01530, 1000=0,00685, 2500=0,00595, 5000=0,00491 (USD); RoHS: Yes; Case/Package: 0201; Case Code (Imperial): 0201; Case Code (Metric): 0603; Min Operating Temperature: -55°C; Max Operating Temperature: 125°C; Packaging: Tape and Reel; Resistance: 47R; Tolerance: 1%; Resistor Type: Thick Film; Termination: SMD/SMT; Number of Terminations: 2; Max Power Dissipation: 50mW; Features: Moisture Resistant; Series: RC; Resistance Tolerance: 1%; Length: 0.6mm; Width: 0.3mm; Height: 0.23mm; Reach SVHC Compliant: Yes; RoHS Compliant: Yes; ComponentLink1URL: https://datasheet.ciiva.com/5924/1563626-5924912.pdf?src-supplier=Farnell; ComponentLink1Description: https://datasheet.ciiva.com/5924/1563626-5924912.pdf?src-supplier=Farnell; ComponentLink2URL: https://datasheet.ciiva.com/22661/1563626-22661319.pdf?src-supplier=Element14; ComponentLink2Description: https://datasheet.ciiva.com/22661/1563626-22661319.pdf?src-supplier=Element14
R80 = Res_0402: Part Description: 698 Ohms ±1% 0.05W, 1/20W Chip Resistor 0201 (0603 Metric) Moisture Resistant Thick Film; Manufacturer: Yageo; Manufacturer Part Number 1: RC0201FR-07698RL; Max Power Dissipation: 50mW; Temperature Coefficient: 200ppm/°C; ComponentLink1URL: https://datasheet.ciiva.com/5924/1563626-5924912.pdf?src-supplier=Farnell; ComponentLink1Description: https://datasheet.ciiva.com/5924/1563626-5924912.pdf?src-supplier=Farnell; ComponentLink2URL: https://datasheet.ciiva.com/22661/1563626-22661319.pdf?src-supplier=Element14; ComponentLink2Description: https://datasheet.ciiva.com/22661/1563626-22661319.pdf?src-supplier=Element14; ComponentLink3URL: https://datasheet.ciiva.com/7672/1563626-7672202.pdf?src-supplier=Element14; ComponentLink3Description: https://datasheet.ciiva.com/7672/1563626-7672202.pdf?src-supplier=Element14; ComponentLink4URL: https://datasheet.ciiva.com/2493/pyu-r-int-thick-7-2493785.pdf?src-supplier=Digi-Key; ComponentLink4Description: https://datasheet.ciiva.com/2493/pyu-r-int-thick-7-2493785.pdf?src-supplier=Digi-Key; ComponentLink5URL: https://datasheet.ciiva.com/2493/pyu-r-int-thick-7-2493786.pdf?src-supplier=Digi-Key; ComponentLink5Description: https://datasheet.ciiva.com/2493/pyu-r-int-thick-7-2493786.pdf?src-supplier=Digi-Key; ComponentLink6URL: https://datasheet.ciiva.com/2493/pyu-r-int-thick-7-2493784.pdf?src-supplier=Digi-Key; ComponentLink6Description: https://datasheet.ciiva.com/2493/pyu-r-int-thick-7-2493784.pdf?src-supplier=Digi-Key; Value: 698R, 1%; Supplier 1: Digi-Key; Supplier Part Number 1: YAG2775CT-ND; Stock 1: 63130; Pricing 1: 1=0,1, 10=0,026, 50=0,0162, 100=0,0136, 500=0,0094, 1000=0,00812, 5000=0,00598 (USD); RoHS: Yes; Case/Package: 0201; Case Code (Metric): 0603; Case Code (Imperial): 0201; Min Operating Temperature: -55°C; Max Operating Temperature: 125°C; Resistance: 698R; Tolerance: 1%; Packaging: Cut Tape; Number of Terminations: 2; Series: RC; RoHS Compliant: Yes; ComponentLink7URL: http://www.yageo.com/documents/recent/PYu-RC_Group_51_RoHS_L_9.pdf?src-supplier=Digi-Key; ComponentLink7Description: http://www.yageo.com/documents/recent/PYu-RC_Group_51_RoHS_L_9.pdf?src-supplier=Digi-Key; ComponentLink8URL: https://www.yageo.com/upload/media/product/productsearch/datasheet/rchip/PYu-RC_Group_51_RoHS_L_11.pdf?src-supplier=Digi-Key; ComponentLink8Description: https://www.yageo.com/upload/media/product/productsearch/datasheet/rchip/PYu-RC_Group_51_RoHS_L_11.pdf?src-supplier=Digi-Key
R81 = Res_0402: Part Description: RES SMD 200 OHM 1% 1/20W 0201; Manufacturer: Yageo; Manufacturer Part Number 1: AC0201FR-07200RL; Max Power Dissipation: 50mW; Temperature Coefficient: 200ppm/°C; Value: 200R, 1%; ComponentLink1URL: https://datasheet.ciiva.com/5924/1563626-5924912.pdf?src-supplier=Farnell; ComponentLink1Description: https://datasheet.ciiva.com/5924/1563626-5924912.pdf?src-supplier=Farnell; ComponentLink2URL: https://datasheet.ciiva.com/22661/1563626-22661319.pdf?src-supplier=Element14; ComponentLink2Description: https://datasheet.ciiva.com/22661/1563626-22661319.pdf?src-supplier=Element14; ComponentLink3URL: https://datasheet.ciiva.com/7672/1563626-7672202.pdf?src-supplier=Element14; ComponentLink3Description: https://datasheet.ciiva.com/7672/1563626-7672202.pdf?src-supplier=Element14; ComponentLink4URL: https://datasheet.ciiva.com/2493/pyu-r-int-thick-7-2493785.pdf?src-supplier=Digi-Key; ComponentLink4Description: https://datasheet.ciiva.com/2493/pyu-r-int-thick-7-2493785.pdf?src-supplier=Digi-Key; ComponentLink5URL: https://datasheet.ciiva.com/2493/pyu-r-int-thick-7-2493786.pdf?src-supplier=Digi-Key; ComponentLink5Description: https://datasheet.ciiva.com/2493/pyu-r-int-thick-7-2493786.pdf?src-supplier=Digi-Key; ComponentLink6URL: https://datasheet.ciiva.com/2493/pyu-r-int-thick-7-2493784.pdf?src-supplier=Digi-Key; ComponentLink6Description: https://datasheet.ciiva.com/2493/pyu-r-int-thick-7-2493784.pdf?src-supplier=Digi-Key; Supplier 1: Digi-Key; Supplier Part Number 1: YAG5171CT-ND; Stock 1: 50812; Pricing 1: 1=0,1, 10=0,035, 50=0,0228, 100=0,0193, 500=0,01342, 1000=0,01169, 5000=0,0087 (USD); RoHS: Yes; Case/Package: 0201; Min Operating Temperature: -55°C; Max Operating Temperature: 155°C; Packaging: Tape and Reel; Resistance: 200R; Number of Terminations: 2; Tolerance: 1%; Features: Moisture Resistant,Automotive AEC-Q200; Series: AC; Length: 0.024inch; Width: 0.012inch; Height: 0.01inch; RoHS Compliant: Yes; ComponentLink7URL: http://www.yageo.com/NewPortal/yageodocoutput?fileName=/pdf/R-Chip/PYu-AC_51_RoHS_L_6.pdf&src-supplier=Digi-Key; ComponentLink7Description: http://www.yageo.com/NewPortal/yageodocoutput?fileName=/pdf/R-Chip/PYu-AC_51_RoHS_L_6.pdf&src-supplier=Digi-Key; ComponentLink8URL: http://www.yageo.com/NewPortal/yageodocoutput?fileName=/pdf/R-Chip/PYu-AC_51_RoHS_L_5.pdf&src-supplier=Digi-Key; ComponentLink8Description: http://www.yageo.com/NewPortal/yageodocoutput?fileName=/pdf/R-Chip/PYu-AC_51_RoHS_L_5.pdf&src-supplier=Digi-Key
R82 R86 = Res_0402: Part Description: RES 6.8 OHM 1% 1/20W 0201; Manufacturer: Yageo; Manufacturer Part Number 1: RC0201FR-076R8L; Power Rating: 50mW; Temperature Coefficient: 350ppm/°C; Value: 6.8R, 1%; Supplier 1: Digi-Key; Supplier Part Number 1: 13-RC0201FR-076R8LCT-ND; Stock 1: 33604; Pricing 1: 1=0,1, 10=0,036, 50=0,023, 100=0,0194, 500=0,01352, 1000=0,01177, 5000=0,00876 (USD); RoHS: Yes; Case/Package: 0201; Case Code (Metric): 0603; Case Code (Imperial): 0201; Min Operating Temperature: -55°C; Max Operating Temperature: 125°C; Resistance: 6.8R; Tolerance: 1%; Packaging: Tape and Reel; Resistor Type: Thick Film; Number of Terminations: 2; Max Power Dissipation: 50mW; Features: Moisture Resistant; Series: RC; Resistance Tolerance: 1%; Length: 0.024inch; Width: 0.012inch; Height: 0.01inch; RoHS Compliant: Yes; Reach SVHC Compliant: Unknown; ComponentLink1URL: https://datasheet.ciiva.com/22661/1563626-22661333.pdf?src-supplier=Element14; ComponentLink1Description: https://datasheet.ciiva.com/22661/1563626-22661333.pdf?src-supplier=Element14
R83 = Res_0402: Part Description: 5.1 Ohms ±1% 0.05W, 1/20W Chip Resistor 0201 (0603 Metric) Moisture Resistant Thick Film; Manufacturer: Yageo; Manufacturer Part Number 1: RC0201FR-075R1L; Value: 5R1, 1%; ComponentLink1URL: https://datasheet.ciiva.com/5924/1563626-5924912.pdf?src-supplier=Farnell; ComponentLink1Description: https://datasheet.ciiva.com/5924/1563626-5924912.pdf?src-supplier=Farnell; ComponentLink2URL: https://datasheet.ciiva.com/22661/1563626-22661319.pdf?src-supplier=Element14; ComponentLink2Description: https://datasheet.ciiva.com/22661/1563626-22661319.pdf?src-supplier=Element14; ComponentLink3URL: https://datasheet.ciiva.com/7672/1563626-7672202.pdf?src-supplier=Element14; ComponentLink3Description: https://datasheet.ciiva.com/7672/1563626-7672202.pdf?src-supplier=Element14; ComponentLink4URL: https://datasheet.ciiva.com/2493/pyu-r-int-thick-7-2493785.pdf?src-supplier=Digi-Key; ComponentLink4Description: https://datasheet.ciiva.com/2493/pyu-r-int-thick-7-2493785.pdf?src-supplier=Digi-Key; ComponentLink5URL: https://datasheet.ciiva.com/2493/pyu-r-int-thick-7-2493786.pdf?src-supplier=Digi-Key; ComponentLink5Description: https://datasheet.ciiva.com/2493/pyu-r-int-thick-7-2493786.pdf?src-supplier=Digi-Key; ComponentLink6URL: https://datasheet.ciiva.com/2493/pyu-r-int-thick-7-2493784.pdf?src-supplier=Digi-Key; ComponentLink6Description: https://datasheet.ciiva.com/2493/pyu-r-int-thick-7-2493784.pdf?src-supplier=Digi-Key; Supplier 1: Digi-Key; Supplier Part Number 1: 13-RC0201FR-075R1LCT-ND; Stock 1: 59079; Pricing 1: 1=0,1, 10=0,036, 50=0,023, 100=0,0194, 500=0,01352, 1000=0,01177, 5000=0,00876 (USD); RoHS: Yes; ComponentLink7URL: https://datasheet.octopart.com/RC0201FR-075R1L-Yageo-datasheet-164759695.pdf?src-supplier=Future+Electronics; ComponentLink7Description: https://datasheet.octopart.com/RC0201FR-075R1L-Yageo-datasheet-164759695.pdf?src-supplier=Future+Electronics; ComponentLink8URL: http://www.yageo.com/documents/recent/PYu-RC_Group_51_RoHS_L_9.pdf?src-supplier=Digi-Key; ComponentLink8Description: http://www.yageo.com/documents/recent/PYu-RC_Group_51_RoHS_L_9.pdf?src-supplier=Digi-Key
R87 = Res_0402: Manufacturer: Yageo; Manufacturer Part Number 1: RC0201FR-071KL; Part Description: 1 kOhms ±1% 0.05W, 1/20W Chip Resistor 0201 (0603 Metric) Moisture Resistant Thick Film; Resistance: 1kR; Power Rating: 50mW; Voltage Rating: 25V; Temperature Coefficient: 200ppm/°C; Value: 1k, 1%; Supplier 1: Digi-Key; Supplier Part Number 1: 311-1KMDKR-ND; Stock 1: 9099863; Pricing 1: 1=0,10000, 10=0,03700, 100=0,01530, 1000=0,00685, 2500=0,00595, 5000=0,00491 (USD); RoHS: Yes; Case/Package: 0201; Case Code (Metric): 0603; Case Code (Imperial): 0201; Contact Plating: Tin,Matte; Min Operating Temperature: -55°C; Max Operating Temperature: 125°C; Package Quantity: 10000; Packaging: Tape and Reel; Tolerance: 1%; Resistor Type: Thick Film; Number of Terminations: 2; Termination: SMD/SMT; Max Power Dissipation: 50mW; Working Voltage: 25V; Features: Moisture Resistant; Series: RC; Resistance Tolerance: 1%; Technology: THICK FILM; Construction: Rectangular; Length: 0.024inch; Width: 0.012inch; Height: 0.01inch; Depth: 0.3mm; Radiation Hardening: No; Military Standard: Not; Lead Free: Lead Free; RoHS Compliant: Yes; ComponentLink1URL: https://datasheet.ciiva.com/7672/1563626-7672204.pdf?src-supplier=Element14; ComponentLink1Description: https://datasheet.ciiva.com/7672/1563626-7672204.pdf?src-supplier=Element14; ComponentLink2URL: https://datasheet.ciiva.com/22698/1563626-22698505.pdf?src-supplier=Element14; ComponentLink2Description: https://datasheet.ciiva.com/22698/1563626-22698505.pdf?src-supplier=Element14; ComponentLink3URL: https://datasheet.ciiva.com/29721/pyu-r-int-thick-7-29721196.pdf?src-supplier=Digi-Key; ComponentLink3Description: https://datasheet.ciiva.com/29721/pyu-r-int-thick-7-29721196.pdf?src-supplier=Digi-Key; ComponentLink4URL: https://datasheet.ciiva.com/29721/pyu-r-int-thick-7-29721195.pdf?src-supplier=Digi-Key; ComponentLink4Description: https://datasheet.ciiva.com/29721/pyu-r-int-thick-7-29721195.pdf?src-supplier=Digi-Key; ComponentLink5URL: https://datasheet.ciiva.com/8896/pyu-rc0201-51-rohs-l-8-8896174.pdf?src-supplier=Avnet; ComponentLink5Description: https://datasheet.ciiva.com/8896/pyu-rc0201-51-rohs-l-8-8896174.pdf?src-supplier=Avnet
R91-R98 = Res_0402: Manufacturer: Yageo; Manufacturer Part Number 1: RC0100FR-0747RL; Part Description: RES 47 OHM 1% 1/32W 01005; Max Power Dissipation: 30mW; Temperature Coefficient: 300ppm/°C; ComponentLink1URL: https://datasheet.ciiva.com/5924/1563626-5924912.pdf?src-supplier=Farnell; ComponentLink1Description: https://datasheet.ciiva.com/5924/1563626-5924912.pdf?src-supplier=Farnell; ComponentLink2URL: https://datasheet.ciiva.com/22661/1563626-22661319.pdf?src-supplier=Element14; ComponentLink2Description: https://datasheet.ciiva.com/22661/1563626-22661319.pdf?src-supplier=Element14; Case Code (Imperial): 1005; Case Code (Metric): 0402; ComponentLink3Description: http://www.yageo.com.tw/exep/pages/download/literatures/PYu-R_INT-thick_7.pdf?src-supplier=Digi-Key; ComponentLink3URL: http://www.yageo.com.tw/exep/pages/download/literatures/PYu-R_INT-thick_7.pdf?src-supplier=Digi-Key; Features: Moisture Resistant; Height: 0.006inch; Length: 0.016inch; Max Operating Temperature: 125°C; Min Operating Temperature: -55°C; Number of Terminations: 2; Packaging: Tape and Reel; Pricing 1: 1=0,23, 10=0,12, 50=0,0824, 100=0,0709, 500=0,05204, 1000=0,04609, 5000=0,03606, 10000=0,03298 (USD); Resistance: 47R; RoHS: Yes; RoHS Compliant: Yes; Series: RC; Stock 1: 19541; Supplier 1: Digi-Key; Supplier Part Number 1: YAG6360CT-ND; Tolerance: 1%; Value: 47R, 1%; Width: 0.008inch
R99 = Res_0402: Part Description: RES 2.67K OHM 1% 1/20W 0201; Manufacturer: Stackpole Electronics; Manufacturer Part Number 1: RMCF0201FT2K67; Resistance: 2.67kR; Max Power Dissipation: 50mW; Temperature Coefficient: 200ppm/°C; Value: 2.67k, 1%; ComponentLink1URL: https://datasheet.ciiva.com/5924/1563626-5924912.pdf?src-supplier=Farnell; ComponentLink1Description: https://datasheet.ciiva.com/5924/1563626-5924912.pdf?src-supplier=Farnell; ComponentLink2URL: https://datasheet.ciiva.com/22661/1563626-22661319.pdf?src-supplier=Element14; ComponentLink2Description: https://datasheet.ciiva.com/22661/1563626-22661319.pdf?src-supplier=Element14; ComponentLink3URL: https://datasheet.ciiva.com/7660/1421516-7660807.pdf?src-supplier=Element14; ComponentLink3Description: https://datasheet.ciiva.com/7660/1421516-7660807.pdf?src-supplier=Element14; ComponentLink4URL: https://datasheet.ciiva.com/46391/1421516-46391339.pdf?src-supplier=Element14; ComponentLink4Description: https://datasheet.ciiva.com/46391/1421516-46391339.pdf?src-supplier=Element14; ComponentLink5URL: https://datasheet.ciiva.com/2467/pyu-r-int-thick-7-2467110.pdf?src-supplier=Digi-Key; ComponentLink5Description: https://datasheet.ciiva.com/2467/pyu-r-int-thick-7-2467110.pdf?src-supplier=Digi-Key; ComponentLink6URL: https://datasheet.ciiva.com/2467/pyu-r-int-thick-7-2467111.pdf?src-supplier=Digi-Key; ComponentLink6Description: https://datasheet.ciiva.com/2467/pyu-r-int-thick-7-2467111.pdf?src-supplier=Digi-Key; ComponentLink7URL: https://datasheet.ciiva.com/2467/pyu-r-int-thick-7-2467109.pdf?src-supplier=Digi-Key; ComponentLink7Description: https://datasheet.ciiva.com/2467/pyu-r-int-thick-7-2467109.pdf?src-supplier=Digi-Key; Supplier 1: Digi-Key; Supplier Part Number 1: RMCF0201FT2K67CT-ND; Stock 1: 29000; Pricing 1: 1=0,1, 10=0,019, 50=0,0118, 100=0,0098, 500=0,00666, 1000=0,00571, 5000=0,00415 (USD); RoHS: Yes; Mount: Surface Mount; Case/Package: 0201; Case Code (Metric): 0603; Case Code (Imperial): 0201; Contact Plating: Tin,Matte; Min Operating Temperature: -55°C; Max Operating Temperature: 125°C; Packaging: Tape and Reel; Tolerance: 1%; Number of Terminations: 2; Series: RMCF; Radiation Hardening: No; RoHS Compliant: Yes; ComponentLink8URL: https://www.seielect.com/Catalog/SEI-RMCF_RMCP.pdf?src-supplier=Digi-Key; ComponentLink8Description: https://www.seielect.com/Catalog/SEI-RMCF_RMCP.pdf?src-supplier=Digi-Key; ComponentLink9URL: https://www.seielect.com/catalog/SEI-RMCF_RMCP.pdf?src-supplier=Avnet; ComponentLink9Description: https://www.seielect.com/catalog/SEI-RMCF_RMCP.pdf?src-supplier=Avnet